# EAGLE design estop_rx (EAGLE 9.4.2)
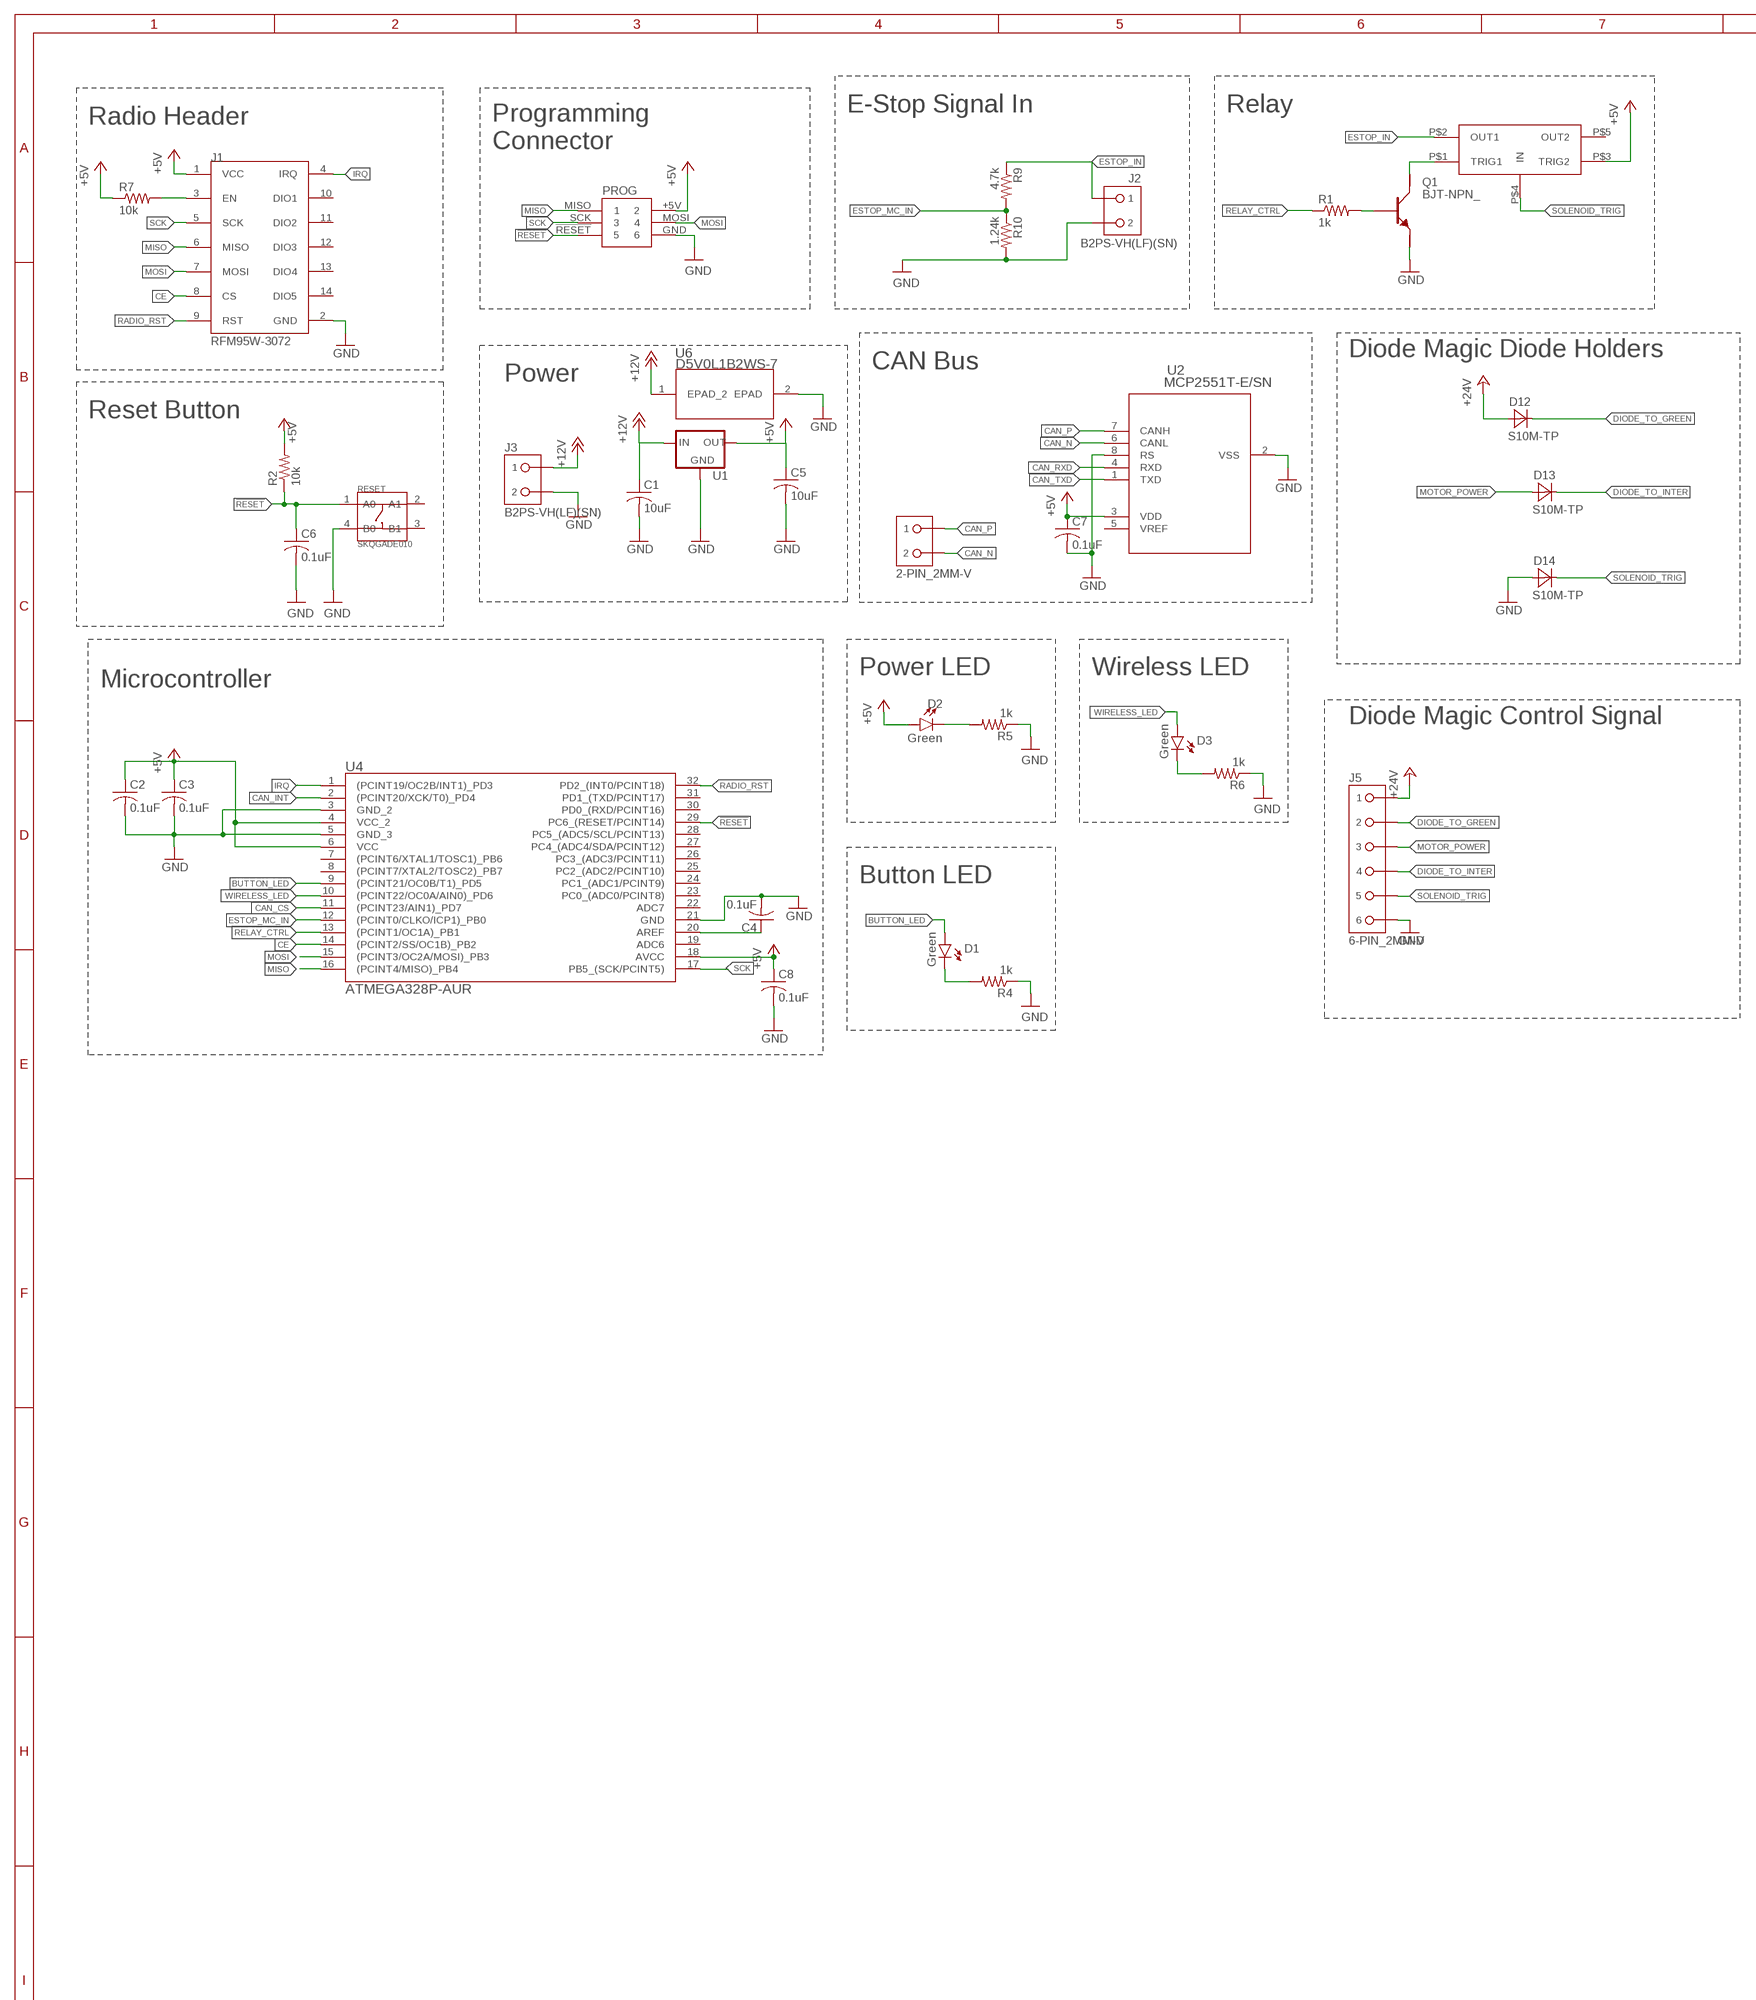
[diagram p0: schematic, sheet 1, part 1 of 2]
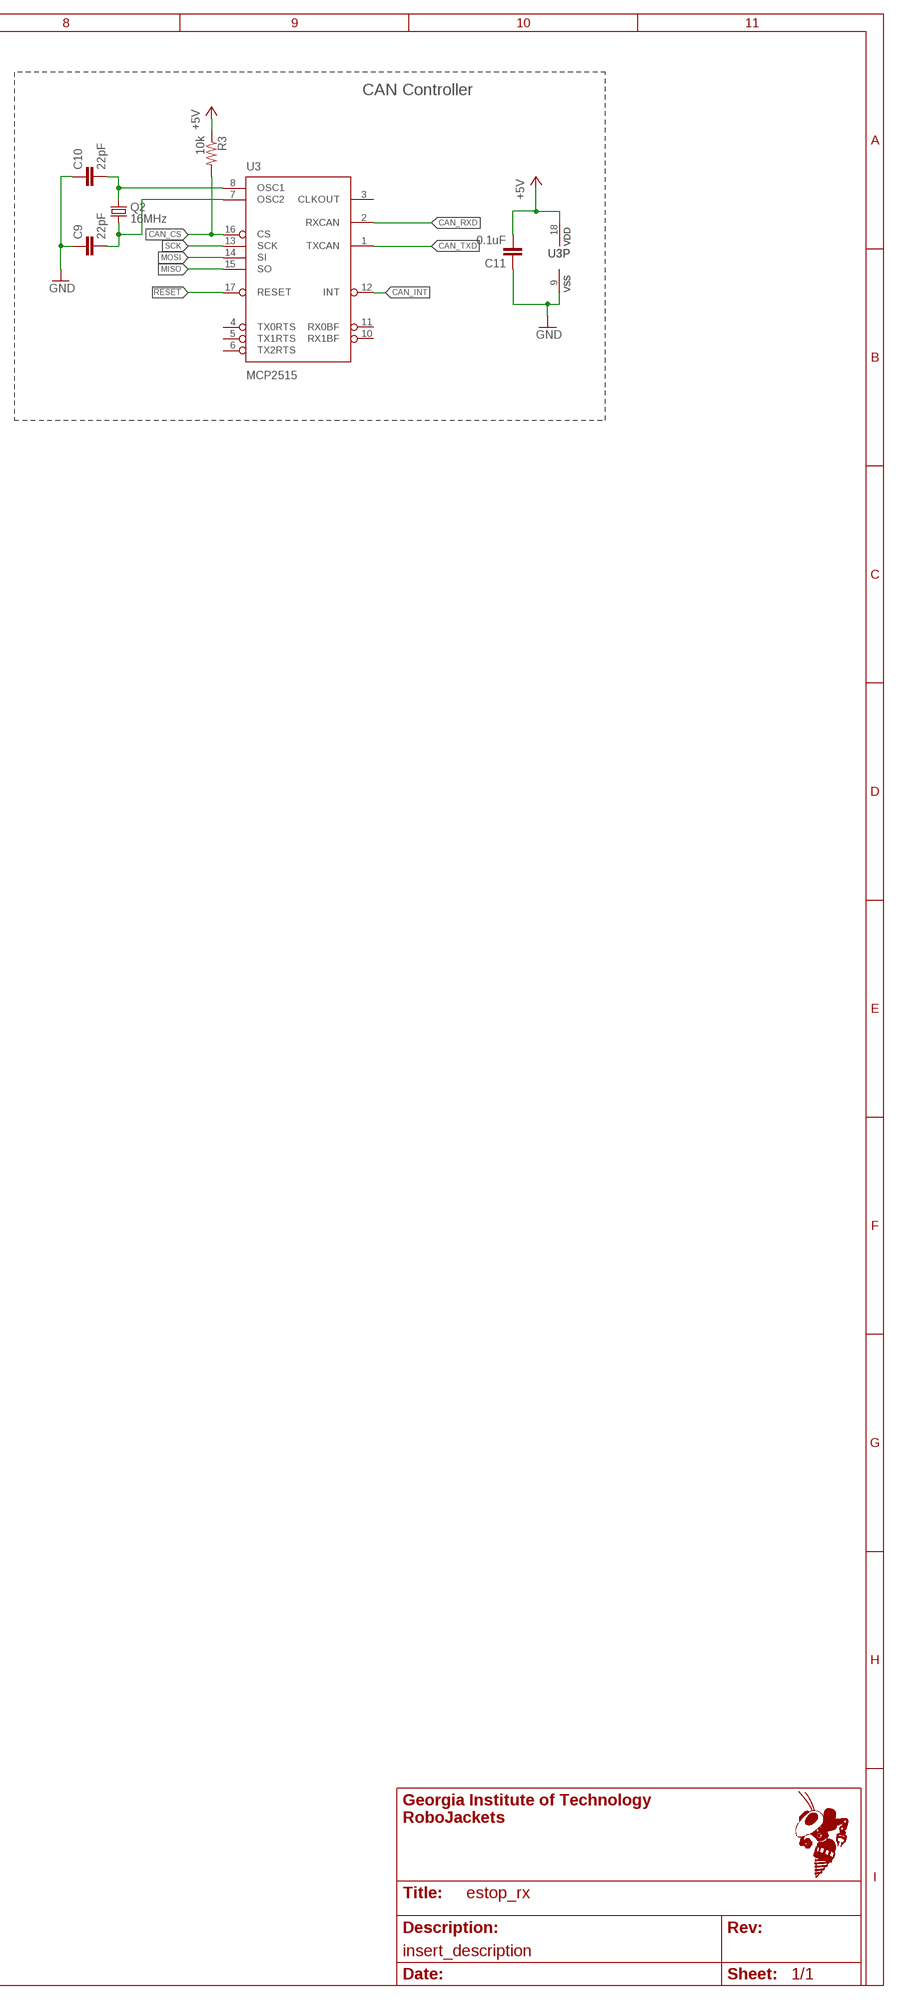
[diagram p1: schematic, sheet 1, part 2 of 2]
FRAME1 (FRAME_C_L): SCH_DESC: insert_description

## Parts
C1  10uF  C-USC0805  [C0805]
C2  0.1uF  C-USC0603  [C0603]
C3  0.1uF  C-USC0603  [C0603]
C4  0.1uF  C-USC0603  [C0603]
C5  10uF  C-USC0805  [C0805]
C6  0.1uF  C-USC0603  [C0603]
C7  0.1uF  C-USC0603  [C0603]
C8  0.1uF  C-USC0603  [C0603]
C9  22pF  22PF-50V-5%(0603)  [0603-CAP]
C10  22pF  22PF-50V-5%(0603)  [0603-CAP]
C11  0.1uF  0.1UF-25V(+80/-20%)(0603)  [0603-CAP]
D1  Green  LED-YELLOW0603  [LED-0603]
D2  Green  LED-YELLOW0603  [LED-0603]
D3  Green  LED-YELLOW0603  [LED-0603]
D12  S10M-TP  [SMC]
D13  S10M-TP  [SMC]
D14  S10M-TP  [SMC]
J1  RFM95W-3072  [RFM95W-3072]
J2  B2PS-VH(LF)(SN)  [B2PS-CENTERED]
J3  B2PS-VH(LF)(SN)  [B2PS-CENTERED]
J4  2-PIN_2MM-V  [2MM-2-V]
J5  6-PIN_2MM-V  [2MM-6-V]
PROG  ICSP Connector  2X3SHROUDED  [2X3SHROUDED]
Q1  BJT-NPN_  [SOT-23-3]
Q2  16MHz  CRYSTAL5X3  [CRYSTAL-SMD-5X3]
R1  1k  R-US_R0603  [R0603]
R2  10k  R-US_R0603  [R0603]
R3  10k  R-US_R0603  [R0603]
R4  1k  R-US_R0603  [R0603]
R5  1k  R-US_R0603  [R0603]
R6  1k  R-US_R0603  [R0603]
R7  10k  R-US_R0603  [R0603]
R9  4.7k  R-US_R0603  [R0603]
R10  1.24k  R-US_R0603  [R0603]
RESET  SKQGADE010  SMD-SWITCH-TOP-260GF(4P-D5.2MM)  [SW4-SMD-5.2X5.2X1.5MM]
U1  R-78E5.0-1.0CONV_R-78E5.0-1.0  [CONV_R-78E5.0-1.0]
U2  MCP2551T-E/SN  [SOIC8-N_MC]
U3  MCP2515  MCP2510SO  [SO-18W]
U4  ATMEGA328P-AUR  [ATMEGA328P-AUR]
U6  D5V0L1B2WS-7  [SOD323]
U$1  G5LE-14  [G5LE-14]

## Nets
!RESET: C6.1 PROG.!RESET R2.1 RESET.1(A0) U3.17(RESET) U4.29(PC6_(RESET/PCINT14))
+5V: C2.1 C3.1 C5.1 C7.1 C8.1 C11.2 D2.A J1.1(VCC) PROG.+5V R2.2 R3.1 R7.1 U1.3(OUT) U2.3(VDD) U3.18(VDD) U4.4(VCC_2) U4.6(VCC) U4.18(AVCC) U$1.P$3(TRIG2)
+12V: C1.1 J3.1 U1.1(IN) U6.1(EPAD_2)
+24V: D12.A J5.1
BUTTON_LED: D1.A U4.9((PCINT21/OC0B/T1)_PD5)
CAN_CS: R3.2 U3.16(CS) U4.11((PCINT23/AIN1)_PD7)
CAN_INT: U3.12(INT) U4.2((PCINT20/XCK/T0)_PD4)
CAN_N: J4.2 U2.6(CANL)
CAN_P: J4.1 U2.7(CANH)
CAN_RXD: U2.4(RXD) U3.2(RXCAN)
CAN_TXD: U2.1(TXD) U3.1(TXCAN)
CE: J1.8(CS) U4.14((PCINT2/SS/OC1B)_PB2)
DIODE_TO_GREEN: D12.C J5.2
DIODE_TO_INTER: D13.C J5.4
ESTOP_IN: J2.1 R9.1 U$1.P$2(OUT1)
ESTOP_MC_IN: R9.2 R10.1 U4.12((PCINT0/CLKO/ICP1)_PB0)
GND: C1.2 C2.2 C3.2 C4.2 C5.2 C6.2 C7.2 C8.2 C9.1 C10.1 C11.1 D14.A J1.2(GND) J2.2 J3.2 J5.6 PROG.GND Q1.2(E) R4.1 R5.1 R6.1 R10.2 RESET.4(B0) U1.2(GND) U2.2(VSS) U2.8(RS) U3.9(VSS) U4.3(GND_2) U4.5(GND_3) U4.21(GND) U6.2(EPAD)
IRQ: J1.4(IRQ) U4.1((PCINT19/OC2B/INT1)_PD3)
MISO: J1.6(MISO) PROG.MISO U3.15(SO) U4.16((PCINT4/MISO)_PB4)
MOSI: J1.7(MOSI) PROG.MOSI U3.14(SI) U4.15((PCINT3/OC2A/MOSI)_PB3)
MOTOR_POWER: D13.A J5.3
N$1: Q1.3(C) U$1.P$1(TRIG1)
N$2: D2.C R5.2
N$3: D1.C R4.2
N$4: D3.C R6.2
N$5: Q1.1(B) R1.2
N$6: J1.3(EN) R7.2
N$9: C4.1 U4.20(AREF)
N$17: C10.2 Q2.3 U3.8(OSC1)
N$18: C9.2 Q2.1 U3.7(OSC2)
RADIO_RST: J1.9(RST) U4.32(PD2_(INT0/PCINT18))
RELAY_CTRL: R1.1 U4.13((PCINT1/OC1A)_PB1)
SCK: J1.5(SCK) PROG.SCK U3.13(SCK) U4.17(PB5_(SCK/PCINT5))
SOLENOID_TRIG: D14.C J5.5 U$1.P$4(IN)
WIRELESS_LED: D3.A U4.10((PCINT22/OC0A/AIN0)_PD6)
Unconnected: J1.10(DIO1) J1.11(DIO2) J1.12(DIO3) J1.13(DIO4) J1.14(DIO5) RESET.2(A1) RESET.3(B1) U2.5(VREF) U3.3(CLKOUT) U3.4(TX0RTS) U3.5(TX1RTS) U3.6(TX2RTS) U3.10(RX1BF) U3.11(RX0BF) U4.7((PCINT6/XTAL1/TOSC1)_PB6) U4.8((PCINT7/XTAL2/TOSC2)_PB7) U4.19(ADC6) U4.22(ADC7) U4.23(PC0_(ADC0/PCINT8)) U4.24(PC1_(ADC1/PCINT9)) U4.25(PC2_(ADC2/PCINT10)) U4.26(PC3_(ADC3/PCINT11)) U4.27(PC4_(ADC4/SDA/PCINT12)) U4.28(PC5_(ADC5/SCL/PCINT13)) U4.30(PD0_(RXD/PCINT16)) U4.31(PD1_(TXD/PCINT17)) U$1.P$5(OUT2)

## Notes on the sheet
- CAN Controller
- E-Stop Signal In | Relay
- Radio Header
- Programming
  Connector
- Diode Magic Diode Holders
- CAN Bus
- Power
- Reset Button
- Power LED | Wireless LED
- Microcontroller
- Diode Magic Control Signal
- Button LED

## Library data of the parts
C1-C5 C7 C8 = rcl:C-US: CAPACITOR, American symbol; SPICEPREFIX: C
C6 = resistor:C-US: CAPACITOR, American symbol
C9 C10 = SparkFun-Capacitors:22PF-50V-5%(0603): CAP-07876; PROD_ID: CAP-07876
C11 = SparkFun-Capacitors:0.1UF-25V(+80/-20%)(0603): CAP-00810 Ceramic Standard decoupling cap; PROD_ID: CAP-00810
D1-D3 = SparkFun-LED:LED-YELLOW: Yellow SMD LED Used in manufacturing several products at SparkFun. Packages: 0603 - SMD 0603 package[Product Link] <http://www.kingbrightusa.com/product.asp?catalog_name=LED&product_id=APT1608SYCK> 0603 -SMART - SMART SMD 0603 package (more efficient/more expensive) [Product Link] <http://www.osram-os.com/osram_os/en/products/product-catalog/led-light-emitting-diodes/smartled-0603/ly-l29k/index.jsp> LilyPad - SMD1206 package[Product Datasheet] <https://www.sparkfun.com/datasheets/DevTools/LilyPad/Q150YUS4.pdf> SparkFun Products: Blynk Board <https://www.sparkfun.com/products/13794> IOIO-OTG <https://www.sparkfun.com/products/13613> XBee Explorer Serial <https://www.sparkfun.com/products/13225>; PROD_ID: DIO-09003; VALUE: Yellow
D12-D14 = IGVC-Discrete:S10M-TP
J1 = IGVC-Connector:RFM95W-3072: Adafruit Breakout Board for RFM95W Radio Module
J2 J3 = RoboJackets-Connectors:B2P?-VH(LF)(SN): Power Connector Brand: JST Sales America Inc. <https://www.jst.com/> Series: VH <http://www.digikey.com/product-search/en?FV=fff40016,fff802f3,ffec0e9d> Distributor: Digi-Key <http://www.digikey.com/product-detail/en/B2PS-VH%28LF%29%28SN%29/455-1648-ND/926555>; DIGIKEY: 455-1648-ND; MPN: B2PS-VH(LF)(SN)
J4 = RoboJackets-Connectors:2-PIN_2MM-*; PINS: 2; PIN_PITCH: 2.0 mm
J5 = RoboJackets-Connectors:6-PIN_2MM-*; PINS: 6; PIN_PITCH: 2.0 mm
PROG = lcd-buzzer:2X3SHROUDED
Q1 = RoboJackets-Discrete:BJT-NPN_*
Q2 = SparkFun-FreqCtrl:CRYSTAL: Various standard crystals. Proven footprints.; PROD_ID: XTAL-08218
R1 R2 R7 = rcl:R-US_: RESISTOR, American symbol; SPICEPREFIX: R
R3-R6 R9 R10 = resistor:R-US_: RESISTOR, American symbol
RESET = rgb-led:SMD-SWITCH-TOP-260GF(4P-D5.2MM): 311020017; MPN: SKQGADE010
U1 = IGVC-Regulator:R-78E5.0-1.0: Recom Power 5V 1A DC/DC Converter The Recom R-78E5.0-X.X is a compact DC/DC converter module that is a pin for pin drop-in replacement for the LM7805 linear voltage regulator. Specifications: Input Range: 7-28V Output Voltage: 5V Output Current: 1A Max Efficiency: 91% Datasheet <https://www.recom-power.com/pdf/Innoline/R-78Exx-1.0.pdf>
U2 = IGVC-Microcontroller:MCP2551T-E/SN; MANUFACTURER_PART_NUMBER: MCP2551TESN; VENDOR: Microchip
U3 = SparkFun-DigitalIC:MCP2510: CAN controller with SPI interface to any MCU. Original design by Microchip.; PROD_ID: IC-09906
U4 = lcd-buzzer:ATMEGA328P-*
U6 = IGVC-Discrete:D5V0L1B2WS-7; BUILT_BY: EMA_UL_Team; MANUFACTURER_PART_NUMBER: D5V0L1B2WS-7; VENDOR: Diodes Inc
U$1 = IGVC-Misc:G5LE-14

## Board
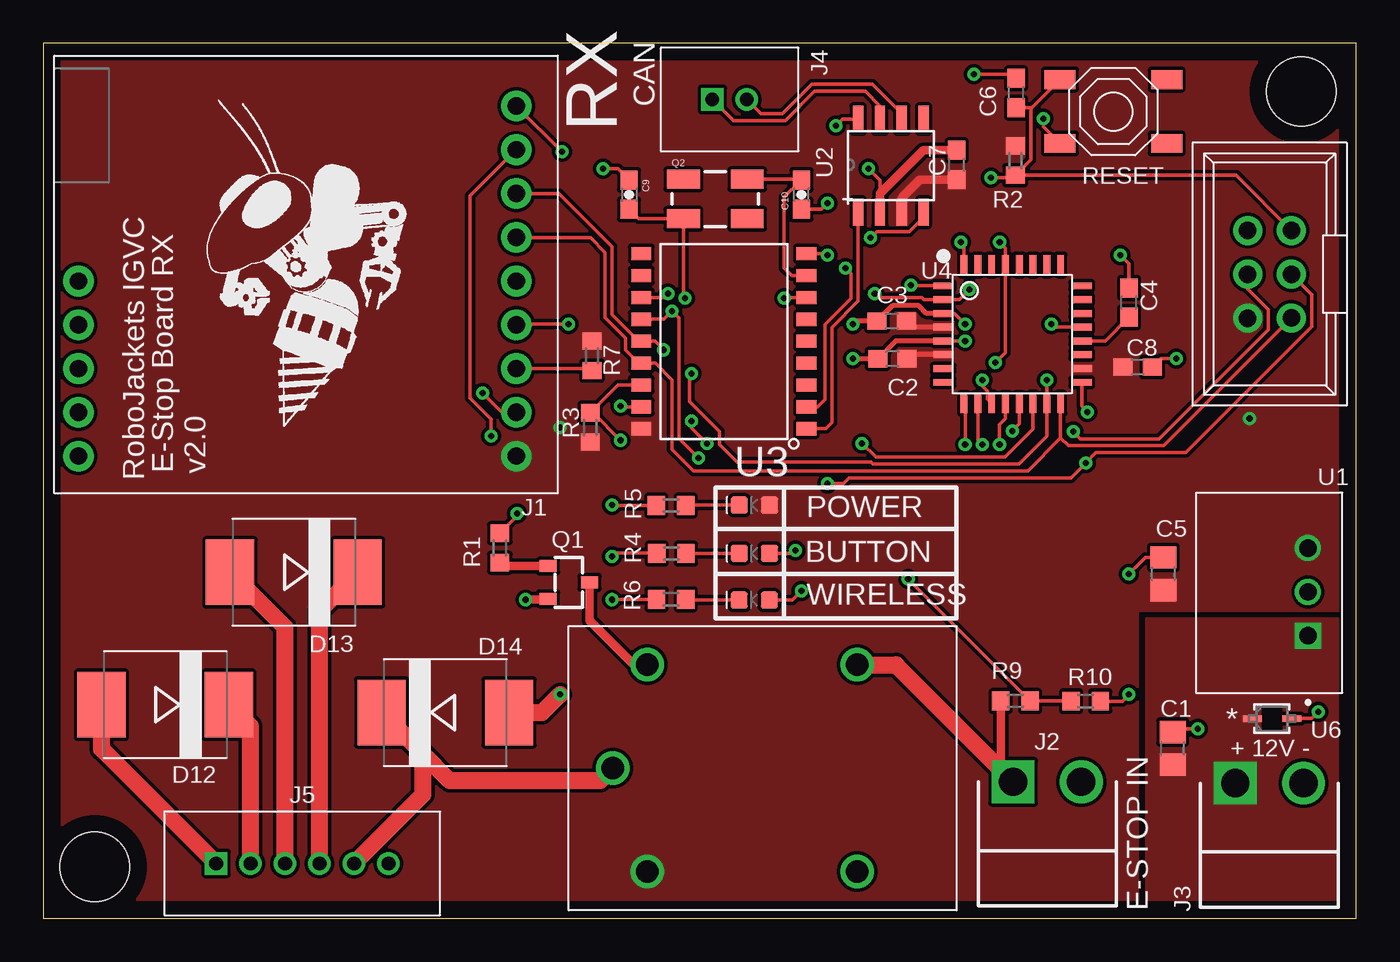
[diagram p2: board, top side]
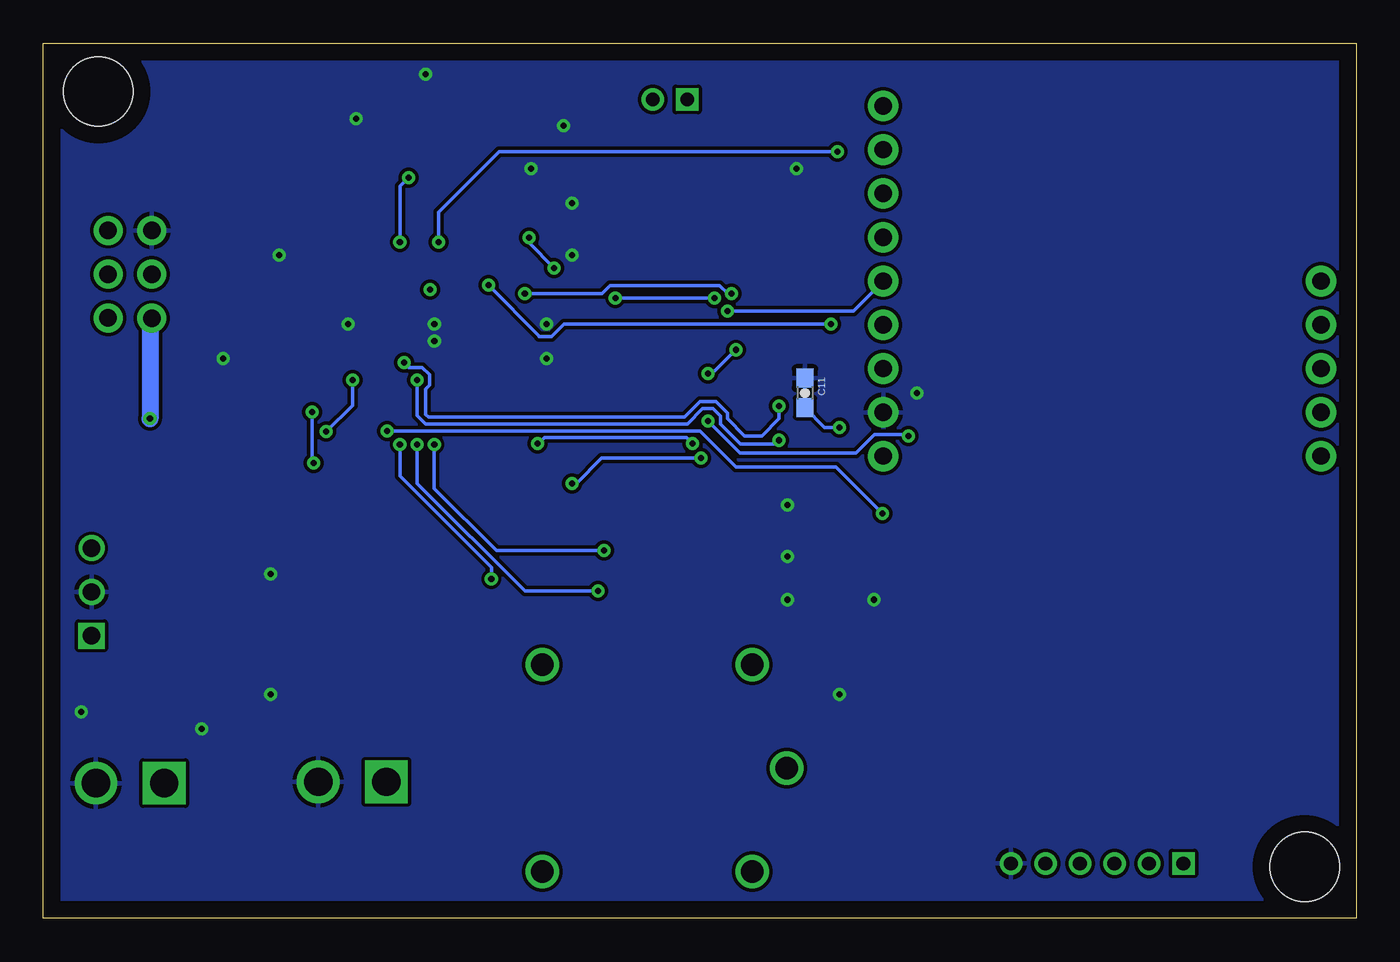
[diagram p3: board, bottom side, seen from below]

Size 76.2 x 50.8 mm. Coordinates in mm from the lower left corner, seen from the top.
Outline: 0,0 76.2,0 76.2,50.8 0,50.8 0,0
Copper layers (1*16): Top 0.035mm / dielectric 1.5mm / Bottom 0.035mm
Design rules "default *": minimum track width 0.2mm, minimum drill 0.35mm, track to track 0.2mm, track to pad 0.25mm, pad to pad 0.2mm, via to via 0.2mm, smd to smd 0.2mm, copper to edge 1mm, drill to drill 0.2mm, minimum pad ring 10mil, minimum via ring 8mil, stop-mask expansion 4mil, vias tented up to drill 0mil, thermal gap 10mil
Holes 4 mm at 3,3 73,48

### Footprints (pad centres in the part's own frame; a part is rotated, then mirrored left to right if it is on the bottom)
C0805 = smd 1.3 x 1.5: 1 -0.95,0; 2 0.95,0
C0603 = smd 1.1 x 1: 1 -0.85,0; 2 0.85,0
0603-CAP = smd 1.1 x 1: 1 -0.85,0; 2 0.85,0
LED-0603 = smd 1 x 1: A -0.877,0; C 0.877,0
SMC = smd 2.8 x 3.8: A 3.7,0; C -3.7,0
RFM95W-3072 = drill 1 pad 1.778: 1 -10.541,-12.192; 2 -8.001,-12.192; 3 -5.461,-12.192; 4 -2.921,-12.192; 5 -0.381,-12.192; 6 2.159,-12.192; 7 4.699,-12.192; 8 7.239,-12.192; 9 9.779,-12.192; 10 -10.541,13.208; 11 -8.001,13.208; 12 -5.461,13.208; 13 -2.921,13.208; 14 -0.381,13.208
B2PS-CENTERED = drill 1.65 square: 1 -1.98,0 | drill 1.65: 2 1.98,0
2MM-2-V = drill 0.8 square: 1 -1,0 | drill 0.8: 2 1,0
2MM-6-V = drill 0.8 square: 1 -4,0 | drill 0.8: 2 -2,0; 3 0,0; 4 2,0; 5 4,0; 6 6,0
2X3SHROUDED = drill 1.02 pad 1.676: !RESET -2.54,1.27; +5V 2.554,-1.27; GND -2.54,-1.27; MISO 2.54,1.27; MOSI 0,-1.27; SCK 0,1.27
SOT-23-3 = smd 0.7 x 1: 1 -0.95,-1.2; 2 0.95,-1.2; 3 0,1.2
CRYSTAL-SMD-5X3 = smd 1.9 x 1.1: 1 -1.85,-1.15; 2 1.85,-1.15; 3 1.85,1.15; 4 -1.85,1.15
R0603 = smd 1 x 1.1: 1 -0.85,0; 2 0.85,0
SW4-SMD-5.2X5.2X1.5MM = smd 1.8 x 1.1: 1 -3.1,1.85; 2 3.1,1.85; 3 3.1,-1.85; 4 -3.1,-1.85
CONV_R-78E5.0-1.0 = drill 1 square: 1 -2.54,-2.25 | drill 1: 2 0,-2.25; 3 2.54,-2.25
SOIC8-N_MC = smd 1.55 x 0.6: 1 -0.75,-0.595; 2 -0.75,-1.865; 3 -0.75,-3.135; 4 -0.75,-4.405; 5 4.65,-4.405; 6 4.65,-3.135; 7 4.65,-1.865; 8 4.65,-0.595
SO-18W = smd 0.762 x 1.143: 1 -5.08,-4.788; 2 -3.81,-4.788; 3 -2.54,-4.788; 4 -1.27,-4.788; 5 0,-4.788; 6 1.27,-4.788; 7 2.54,-4.788; 8 3.81,-4.788; 9 5.08,-4.788; 10 5.08,4.788; 11 3.81,4.788; 12 2.54,4.788; 13 1.27,4.788; 14 0,4.788; 15 -1.27,4.788; 16 -2.54,4.788; 17 -3.81,4.788; 18 -5.08,4.788
ATMEGA328P-AUR = smd 1.15 x 0.4: 1 -3.946,2.603; 2 -3.955,1.803; 3 -3.955,1.003; 4 -3.955,0.203; 5 -3.955,-0.597; 6 -3.955,-1.397; 7 -3.955,-2.197; 8 -3.955,-2.997; 17 4.085,-2.997; 18 4.085,-2.197; 19 4.085,-1.397; 20 4.085,-0.597; 21 4.085,0.203; 22 4.085,1.003; 23 4.085,1.803; 24 4.085,2.603 | smd 0.4 x 1.15: 9 -2.743,-4.21; 10 -1.943,-4.21; 11 -1.143,-4.207; 12 -0.343,-4.21; 13 0.457,-4.21; 14 1.257,-4.207; 15 2.057,-4.207; 16 2.857,-4.207; 25 2.857,3.813; 26 2.057,3.813; 27 1.257,3.813; 28 0.457,3.811; 29 -0.343,3.811; 30 -1.143,3.813; 31 -1.943,3.811; 32 -2.743,3.811
SOD323 = smd 1.111 x 0.401: 1 -1.15,0; 2 1.15,0
G5LE-14 = drill 1.3: P$1 4.55,14.25; P$2 16.75,14.25; P$3 4.55,2.25; P$4 2.55,8.25; P$5 16.75,2.25

### Placement (x,y rotation side)
C1  65.54,9.87 90 top
C2  49.28,32.48 180 top
C3  49.24,34.67 180 top
C4  63.01,35.74 90 top
C5  65,20 90 top
C6  56.46,47.9 90 top
C7  53.01,43.73 90 top
C8  63.5,32 0 top
C9  34,42 270 top
C10  44,42 90 top
C11  32,30.5 270 bottom
D1  41.27,21.19 180 top
D2  41.27,23.99 180 top
D3  41.26,18.48 180 top
D12  7.09,12.4 180 top
D13  14.55,20.08 180 top
D14  23.34,11.95 0 top
J1  15.26,37.37 90 top
J2  58.26,7.93 0 top
J3  71.15,7.86 0 top
J4  39.83,47.53 0 top
J5  14.04,3.19 0 top
PROG  71.16,37.39 270 top
Q1  30.5,19.5 270 top
Q2  39,41.75 0 top
R1  26.5,21.5 270 top
R2  56.41,43.98 90 top
R3  31.75,28.5 90 top
R4  36.45,21.18 0 top
R5  36.43,23.97 0 top
R6  36.44,18.52 0 top
R7  31.85,32.65 270 top
R9  56.41,12.62 0 top
R10  60.49,12.61 0 top
RESET  62.1,46.83 0 top
U1  71.14,18.95 90 top
U2  46.69,41.74 90 top
U3  39.5,33.5 90 top
U4  56.18,34.11 0 top
U6  71.3,11.6 0 top
U$1  30.5,0.47 0 top
U$2  [ROBOBUZZ_1.0X2]  13.93,28.55 0 top

### Tracks (layer width: path | path; a pad name or v marks a point on that pad's centre or on a via)
!RESET  (via drill 0.35)
  Top 0.2: C6.1 57.37,47.05 | 57.37,47.05 RESET.1 | PROG.!RESET 69.23,43.13 R2.1 | R2.1 56.25,43.13 56.12,43 v55,43 | R2.1 57.31,44.03 57.31,46.99 57.37,47.05 | v55.5,39.25 55.84,38.91 U4.29 55.84,32.84 v55.25,32.25 | U3.17 33.56,29.69 v33.5,29.75
  Bottom 0.2: v55.5,39.25 55.5,42.5 v55,43 | v33.5,29.75 33.5,29 34.5,28 35.5,28 36.5,29 36.5,29.32 37.16,29.99 38.1,29.99 38.98,29.1 53.83,29.1 53.99,29.26 53.99,30.73 53.77,30.95 53.77,31.55 54.2,31.98 54.98,31.98 v55.25,32.25
+5V  (via drill 0.35)
  Top 0.3: 62.56,31.91 C8.1 | U4.6 50.36,32.71 C2.1 | U4.4 50.44,34.31 C3.1
  Top 0.5: U2.3 49.83,41.83 50.88,42.88 C7.1
  Bottom 0.2: C11.2 30.85,28.5 v30,28.5
  Bottom 1: PROG.+5V 70,34.72 v70,29
  pour Top (no thermals): 0.2,50.53 0.2,0.17 63.52,0.17 63.52,17.85 76.01,17.85 76.01,50.53
+12V
  pour Top (no thermals): 64,17.41 76,17.41 76,0.19 64,0.19
+24V
  Top 1: J5.1 3.39,9.84 D12.A
BUTTON_LED  (via drill 0.35)
  Top 0.2: U4.9 53.5,29.84 v53.5,27.5 | D1.A 43.49,21.19 v43.65,21.35
  Bottom 0.2: v53.5,27.5 53.5,24.95 49.9,21.35 v43.65,21.35
CAN_CS  (via drill 0.35)
  Top 0.2: U4.11 54.79,30.15 54.79,30.62 54.5,30.91 v54.5,31.25 | v33.5,27.75 31.9,29.35 R3.2 33.36,30.96 U3.16
  Bottom 0.2: v54.5,31.25 54.5,29.2 54,28.7 38.82,28.7 37.93,29.59 37.33,29.59 36.9,29.16 36.9,28.7 35.73,27.52 33.73,27.52 v33.5,27.75
CAN_INT  (via drill 0.35)
  Top 0.2: v53.75,36.5 53.16,35.91 U4.2 51.09,35.91 50.99,36.02 48.48,36.02 v48.25,36.25 | U3.12 36.04,36.04 v36.25,36.25
  Bottom 0.2: v36.25,36.25 36.47,36.25 36.95,36.73 43.3,36.73 43.78,36.25 v48.25,36.25
CAN_N
  Top 0.2: J4.2 41.66,46.7 42.9,46.7 44.6,48.4 48.12,48.4 49.83,46.69 U2.6
CAN_P
  Top 0.2: J4.1 40.06,46.3 43.07,46.3 44.77,48 47.7,48 48.55,47.15 U2.7
CAN_RXD  (via drill 0.35)
  Top 0.2: U2.4 51.05,40.95 51.05,40.65 50.27,39.87 48.38,39.87 v48.01,39.5 | v46.56,37.75 46.88,37.42 46.88,35.98 45.37,34.47 45.37,30.12 44.94,29.69 U3.2
  Bottom 0.2: v46.56,37.75 48.01,39.21 v48.01,39.5
CAN_TXD
  Top 0.2: U3.1 45.42,28.42 45.77,28.77 45.77,34.3 47.28,35.81 U2.1
CE  (via drill 0.35)
  Top 0.2: U4.14 57.44,28.41 55.8,26.77 48.32,26.77 v47.52,27.57 | v38.53,27.57 37.63,28.47 v37.63,28.86 | v26,28 26,28.97 24.77,30.2 24.77,41.93 J1.8
  Bottom 0.2: v47.52,27.57 47.43,27.57 47.1,27.9 38.86,27.9 v38.53,27.57 | v37.63,28.86 35.77,27 29.03,27 27.96,28.07 26.07,28.07 v26,28
DIODE_TO_GREEN
  Top 1: J5.2 12.04,11.15 D12.C
DIODE_TO_INTER
  Top 1: J5.4 16.04,17.88 D13.C
ESTOP_IN
  Top 0.2: 55.56,12.5 R9.1
  Top 0.5: J2.1 55.56,8.64 55.56,12.5
  Top 1: U$1.P$2 49.49,14.72 J2.1
ESTOP_MC_IN  (via drill 0.35)
  Top 0.2: R10.1 59.63,12.62 R9.2 v50.19,19.69 | U4.12 55.84,29 55.5,28.66 v55.5,27.5
  Bottom 0.2: v55.5,27.5 55.5,25.68 50.19,20.38 v50.19,19.69
GND  (via drill 0.35)
  Top 0.2: C1.2 65.54,11 v67,11 | R4.1 35.58,21.2 33.2,21.2 v33,21 | U4.21 58.69,34.31 v58.5,34.5 | C4.2 63.01,37.99 v62.5,38.5 | U4.5 53.49,33.51 v53.5,33.5 | U4.3 52.89,35.11 v53.5,34.5 | R10.2 62.61,12.61 v63,13 | C6.2 56.21,49 v54,49 | U2.8 46.39,46.39 v46,46 | U6.2 73.6,11.6 v74,12 | C5.2 63.95,20.95 v63,20 | U2.2 48.55,42.84 v47.9,43.5 | RESET.4 58.04,45.94 v58.04,46.4 | R6.1 35.56,18.5 v33,18.5 | R5.1 33.03,23.97 v33,24 | J1.2 26.63,29.37 v25.5,30.5 | C9.1 33.35,43.5 v32.5,43.5 | C10.1 45.15,41.15 v45.5,41.5 | C8.2 64.85,32.5 v65.75,32.5 | U3.9 45.42,38.58 v45.5,38.5
  Top 0.3: U4.5 49.46,33.51 C2.2 47.02,32.48 v47,32.5 | U4.3 51.26,35.11 50.81,35.57 49.29,35.57 C3.2 47.17,34.67 v47,34.5
  Top 0.5: Q1.2 29.25,18.5 v28,18.5 | U2.2 48.55,42.05 51.08,44.58 C7.2
  Top 1: D14.A 28.95,11.95 v30,13
  pour Bottom: 0.18,50.48 76,50.48 76,0.17 0.18,0.17
IRQ  (via drill 0.35)
  Top 0.2: J1.4 27.5,34.5 v30.5,34.5 | U4.1 50.36,36.71 v50.36,36.74
  Bottom 0.2: v30.5,34.5 45.97,34.5 46.7,33.77 47.42,33.77 47.42,33.8 v50.36,36.74
MISO
  Top 0.2: 59.04,27.88 U4.16 | PROG.MISO 65.02,27.44 59.48,27.44 59.04,27.88 | 59.04,27.88 57.13,25.97 45.81,25.97 45.8,25.98 37.74,25.98 36.5,27.22 36.5,31.25 35.52,32.23 U3.15 34.53,32.23 33.79,32.97 33.79,33.68 32.6,34.87 32.6,38.65 31.75,39.5 27.48,39.5 J1.6
MOSI  (via drill 0.35)
  Top 0.2: J1.7 29.93,42.07 33,39 33,35.03 34.53,33.5 U3.14 35.5,33.5 v36,33 | PROG.MOSI 69.89,36.51 71.08,35.32 71.08,34.16 64.75,27.84 60.18,27.84 v59.77,28.25 | v58.25,31.25 58.25,29.92 U4.15 58.24,27.99 56.62,26.37 48.15,26.37 48.03,26.5 40.26,26.5 39.26,27.5 39.26,28.26 37.52,30 37.5,30 37.5,31.5 v37.63,31.62
  Bottom 0.2: v36,33 37.5,31.5 v37.63,31.62 | v59.77,28.25 58.25,29.77 v58.25,31.25
MOTOR_POWER
  Top 1: J5.3 14.04,16.89 D13.A
N$1
  Top 0.5: Q1.3 31.7,17.3 34.28,14.72 U$1.P$1
N$2
  Top 0.2: D2.C 37.3,23.99 R5.2
N$3
  Top 0.2: D1.C 37.31,21.19 R4.2
N$4
  Top 0.2: D3.C 37.34,18.48 R6.2
N$5
  Top 0.5: R1.2 26.7,20.45 Q1.1
N$6
  Top 0.2: J1.3 31.74,31.91 R7.2
N$9
  Top 0.2: U4.20 61.63,33.51 C4.1
N$17
  Top 0.2: Q2.3 43.95,42.9 C10.2 43,41.85 43,37.75 43.44,37.31 U3.8
N$18  (via drill 0.35)
  Top 0.2: C9.2 34.55,40.6 Q2.1 37.15,36.1 v37.25,36 | v43,36 43.04,36.04 U3.7
  Bottom 0.2: v37.25,36 v43,36
RADIO_RST  (via drill 0.35)
  Top 0.2: J1.9 v30.11,44.5 | v53.25,39.25 53.44,39.06 U4.32
  Bottom 0.2: v30.11,44.5 49.75,44.5 53.25,41 v53.25,39.25
RELAY_CTRL  (via drill 0.35)
  Top 0.2: v56.23,28.3 56.64,28.71 U4.13 | v27.5,23.5 27.5,23.35 R1.1
  Bottom 0.2: v56.23,28.3 38.1,28.3 36,26.2 30.2,26.2 v27.5,23.5
SCK  (via drill 0.35)
  Top 0.2: v60.6,29.4 60.27,29.73 U4.17 | PROG.SCK 73.62,36.2 73.62,34.35 66.3,27.04 61.09,27.04 v60.5,26.44 59.63,25.57 46.75,25.57 46.43,25.25 v45.5,25.25 | v38.04,26.71 36.9,27.85 36.9,34.85 v36.5,35.25 36.02,34.77 U3.13
  Bottom 0.2: v60.5,26.44 60.6,26.54 v60.6,29.4 | v36.5,35.25 29.19,35.25 J1.5 | v45.5,25.25 45.25,25.25 43.79,26.71 v38.04,26.71
SOLENOID_TRIG
  Top 1: U$1.P$4 32.32,8 23.59,8 22.04,9.54 | 22.04,9.54 D14.C | J5.5 22.04,7.19 22.04,9.54
WIRELESS_LED  (via drill 0.35)
  Top 0.2: U4.10 54.24,27.76 v54.5,27.5 | v44,19 43.48,18.48 D3.A
  Bottom 0.2: v54.5,27.5 54.5,25.25 48.25,19 v44,19

### Text on the board
tPlace: CAN | RX | RoboJackets IGVC | E-Stop Board RX | v2.0 | POWER | BUTTON | WIRELESS | + 12V - | E-STOP IN